# EasyEDA schematic SCH_智能门锁_2026-05-30.json
TITLE: Sheet_1; REV: 1.0; Date: 2026-02-06; Sheet: 1/1; Drawn By: yqw-huan; Company: Your Company

## Parts
GND  有源蜂鸣器模块  [有源蜂鸣器模块]
J1  矩阵按键  [HDR-M-2.54_1X8]
SG90  HDR-M-2.54_1x3  [HDR-M-2.54_1X3]
U1  STM32  [STM32C8T6]
U2  按键4P  [KEY-TH_4P复位按键]
U3  按键4P  [KEY-TH_4P复位按键]
U4  按键4P  [KEY-TH_4P复位按键]
U5  按键4P  [KEY-TH_4P复位按键]
U6  MFRC522  [MFRC522]
U7  0.96OLEDIIC  [0.96OLEDIIC]

## Library data of the parts
GND = 有源蜂鸣器模块: Supplier: Rysim; Contributor: fgdggtgh; Package Display: Yes
J1 = HDR-M-2.54_1x8: Supplier Part: C190820; Supplier: LCSC; Contributor: LCEDA_Lib; Package Display: Yes
SG90 = HDR-M-2.54_1x3: Supplier Part: C180248; Supplier: LCSC; Contributor: LCEDA_Lib; Package Display: Yes
U1 = STM32: Contributor: tan_bubu_1826; Package Display: Yes
U2-U5 = 按键: Contributor: mxayu2020; Package Display: Yes
U6 = MFRC522: Contributor: xlqz; Package Display: Yes
U7 = 0.96OLEDIIC: link: https://item.taobao.com/item.htm?spm=a1z09.2.0.0.5ea22e8doSvR53&id=562145367495&_u=r1ggn9c0621f; Contributor: giaosen; Package Display: Yes

## Nets
3.3V: GND.3(VCC) U1.20(3.3V) U1.38(3.3V) U6.8(3.3V) U7.VCC
5V: SG90.2(VCC) U1.18(5V)
GND: GND.1(GND) SG90.3(CND) U1.19(GND) U1.39(GND) U1.40(GND) U2.3 U3.3 U4.3 U5.3 U6.6(GND) U7.GND
PA0: J1.1(C4) U1.25(PA0)
PA1: SG90.1(PWM) U1.26(PA1)
PA2: J1.4(C1) U1.27(PA2)
PA3: GND.2(I/O) U1.28(PA3)
PA7: U1.32(PA7) U6.1(SDA)
PA9: U1.6(PA9) U4.1
PA12: U1.9(PA12) U5.1
PB0: U1.33(PB0) U6.2(SCK)
PB1: U1.34(PB1) U6.3(MOSI)
PB3: J1.5(R1) U1.11(PB3)
PB4: J1.6(R2) U1.12(PB4)
PB5: J1.7(R2) U1.13(PB5)
PB6: J1.8(R4) U1.14(PB6)
PB8: J1.3(C2) U1.16(PB8)
PB9: J1.2(C3) U1.17(PB9)
PB10: U1.35(PB10) U6.4(MISO)
PB11: U1.36(PB11) U6.7(RST)
PB12: U1.1(PB12) U2.1
PB13: U1.2(PB13) U7.SCL
PB14: U1.3(PB14) U3.1
PB15: U1.4(PB15) U7.SDA

Not connected (* = marked no-connect by the designer): U1 5(PA8)* 7(PA10)* 8(PA11)* 10(PA15)* 15(PB7)* 21(VBAT)* 22(PC13)* 23(PC14)* 24(PC15)* 29(PA4)* 30(PA5)* 31(PA6)* 37(NRST)*; U6 5(IRQ)*
